# Altium schematic sheet Short to GND protection.SchDoc
size A4
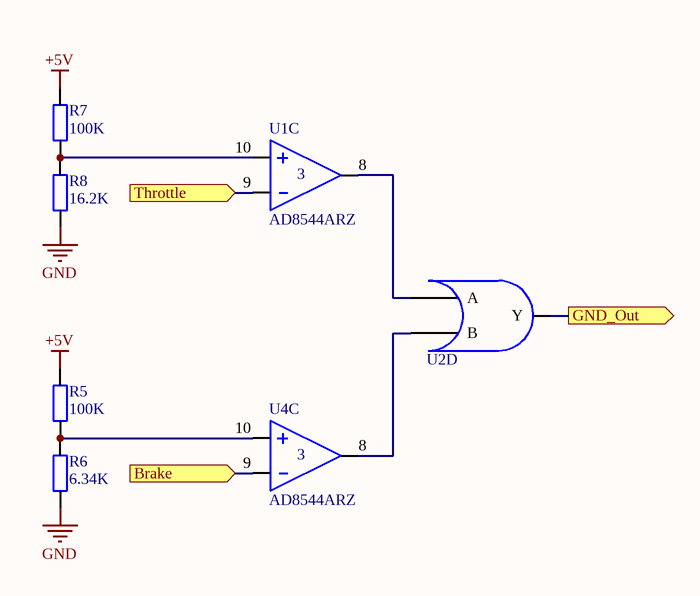
[diagram p0: Short to GND protection.SchDoc]

## Parts
R5  100K  [RESC160X80X50L30N]
R6  6.34K  [RESC160X80X55L25N]
R7  100K  [RESC160X80X50L30N]
R8  16.2K  [RESC157X85X50L30N]
U1  AD8544ARZ  [SOIC14P127_865X600X175L83X41N]  (part C of 4)
U2  CD4071BM  [SOIC14P127_865X600X175L70X42N]  (value not drawn)  (part D of 4)
U4  AD8544ARZ  [SOIC14P127_865X600X175L83X41N]  (part C of 4)

## Ports
Brake (in), GND_Out (out), Throttle (in)

## Nets
+5V: R5.2 R7.2
GND: R6.2 R8.1
Brake: U4.9 ; port Brake
GND_Out: U2.11(Y) ; port GND_Out
Throttle: U1.9 ; port Throttle
NetR5_1: R5.1 R6.1 U4.10
NetR7_1: R7.1 R8.2 U1.10
NetU1_8: U1.8 U2.12(A)
NetU2_13: U2.13(B) U4.8

## Library data of the parts
R5 R7 = R_0603_100K_0W1_C: Manufacturer Part Number: CRCW0603100KFKEAC; Power Rating: 100mW; Resistor Case Style: 0603; Temperature Coefficient: 100 PPM / C; FR_SN: R-34; Part Number: R_0603_100K_0W1_C; Value: 100K; ComponentLink1URL: https://hr.mouser.com/datasheet/2/427/crcwce3-1223726.pdf; ComponentLink1Description: Datasheet; Supplier Part Number: 71-CRCW0603100KFKEAC
R6 = R_0603_6.34K_0W1: Manufacturer Part Number: AC0603FR-076K34L; Power Rating: 100mW; Resistor Case Style: 0603; Temperature Coefficient: 100 PPM / C; FR_SN: R-73; Part Number: R_0603_6.34K_0W1; Value: 6.34K; ComponentLink1URL: https://hr.mouser.com/datasheet/2/447/Yageo_PYu_AC_51_RoHS_L_7_1714230-1874691.pdf; ComponentLink1Description: Datasheet; Supplier Part Number: 603-AC0603FR-076K34L
R8 = R_0603_16.2K_0W1: Manufacturer Part Number: CRCW060316K2FKEA; Power Rating: 100mW; Resistor Case Style: 0603; Temperature Coefficient: 100 PPM/C; FR_SN: R-65; Part Number: R_0603_16.2K_0W1; Value: 16.2K; ComponentLink1URL: https://hr.mouser.com/datasheet/2/427/dcrcwe3-1762152.pdf; ComponentLink1Description: Datasheet; Supplier Part Number: 71-CRCW0603-16.2K-E3
U1 U4 = AD8544: Manufacturer Part Number: AD8544ARZ-REEL; IC Case Style: SOIC-14; ComponentLinkDescription: Datasheet; FR_SN: U_Analog-15; Part Number: AD8544; Value: AD8544ARZ; Category: OP Amp; ComponentLinkURL: https://hr.mouser.com/datasheet/2/609/AD8541_8542_8544-1502176.pdf; Supplier Part Number: 584-AD8544ARZ-R
U2 = CD4071BM: IC Case Style: SO-14; ComponentLinkDescription: Datasheet; FR_SN: IC_Misc-21; Part Number: CD4071BM; Value: CD4071BM; Category: Logic OR Gate; Manufacturer Part Number: CD4071BM; ComponentLinkURL: https://www.ti.com/general/docs/suppproductinfo.tsp?distId=26&gotoUrl=http%3A%2F%2Fwww.ti.com%2Flit%2Fgpn%2Fcd4071b; Supplier Part Number: 595-CD4071BM